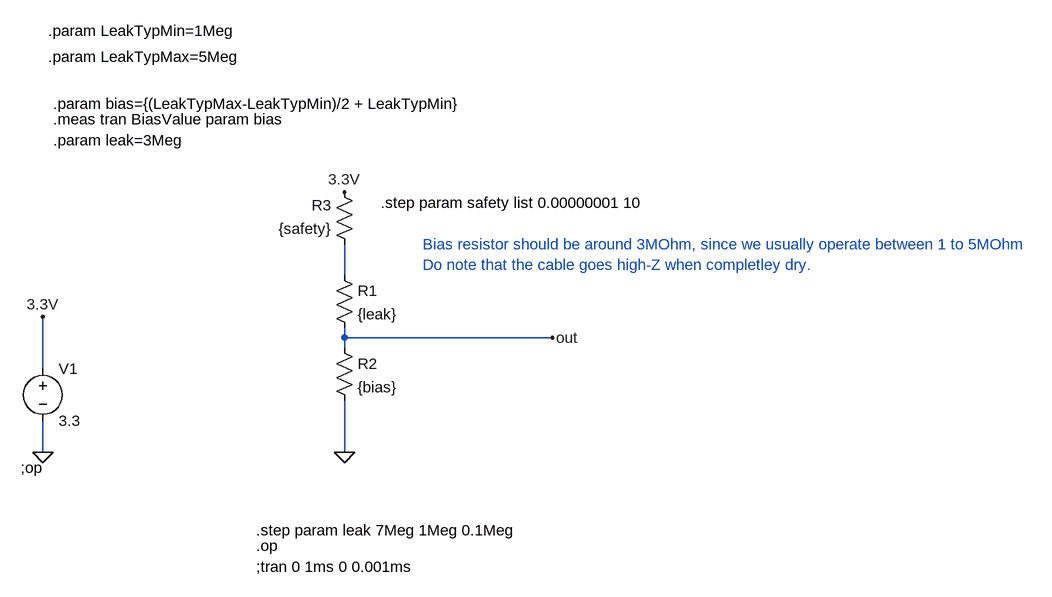
[diagram p0: schematic Leak Detection Cable.asc]
Leak Detection Cable.asc, the LTspice schematic file:
Version 4
SHEET 1 1800 680
WIRE 480 -16 480 -64
WIRE 480 80 480 64
WIRE 800 80 480 80
WIRE 480 96 480 80
WIRE 16 128 16 48
WIRE 16 256 16 208
WIRE 480 256 480 176
FLAG 16 256 0
FLAG 16 48 3.3V
FLAG 480 256 0
FLAG 480 -144 3.3V
FLAG 800 80 out
SYMBOL voltage 16 112 R0
WINDOW 123 0 0 Left 2
WINDOW 39 0 0 Left 2
SYMATTR InstName V1
SYMATTR Value 3.3
SYMBOL res 464 -32 R0
SYMATTR InstName R1
SYMATTR Value {leak}
SYMBOL res 464 80 R0
SYMATTR InstName R2
SYMATTR Value {bias}
SYMBOL res 496 -48 R180
WINDOW 0 36 76 Left 2
WINDOW 3 36 40 Left 2
SYMATTR InstName R3
SYMATTR Value {safety}
TEXT -18 280 Left 2 !;op
TEXT 24 -392 Left 2 !.param LeakTypMin=1Meg
TEXT 24 -352 Left 2 !.param LeakTypMax=5Meg
TEXT 32 -224 Left 2 !.param leak=3Meg
TEXT 344 376 Left 2 !.step param leak 7Meg 1Meg 0.1Meg
TEXT 32 -280 Left 2 !.param bias={(LeakTypMax-LeakTypMin)/2 + LeakTypMin}
TEXT 600 -64 Left 2 ;Bias resistor should be around 3MOhm, since we usually operate between 1 to 5MOhm
TEXT 600 -32 Left 2 ;Do note that the cable goes high-Z when completley dry.
TEXT 32 -256 Left 2 !.meas tran BiasValue param bias
TEXT 344 432 Left 2 !;tran 0 1ms 0 0.001ms
TEXT 344 400 Left 2 !.op
TEXT 536 -128 Left 2 !.step param safety list 0.00000001 10

The netlist it stands for:
* Leak Detection Cable.asc
V1 3.3V 0 3.3
R1 N001 out {leak}
R2 out 0 {bias}
R3 N001 3.3V {safety}
;op
.param LeakTypMin=1Meg
.param LeakTypMax=5Meg
.param leak=3Meg
.step param leak 7Meg 1Meg 0.1Meg
.param bias={(LeakTypMax-LeakTypMin)/2 + LeakTypMin}
* Bias resistor should be around 3MOhm, since we usually operate between 1 to 5MOhm
* Do note that the cable goes high-Z when completley dry.
.meas tran BiasValue param bias
;tran 0 1ms 0 0.001ms
.op
.step param safety list 0.00000001 10
.backanno
.end